# EAGLE design NanoRS485-MySens-v002 (EAGLE 7.6.0)
MAPLE-CUx Large Version
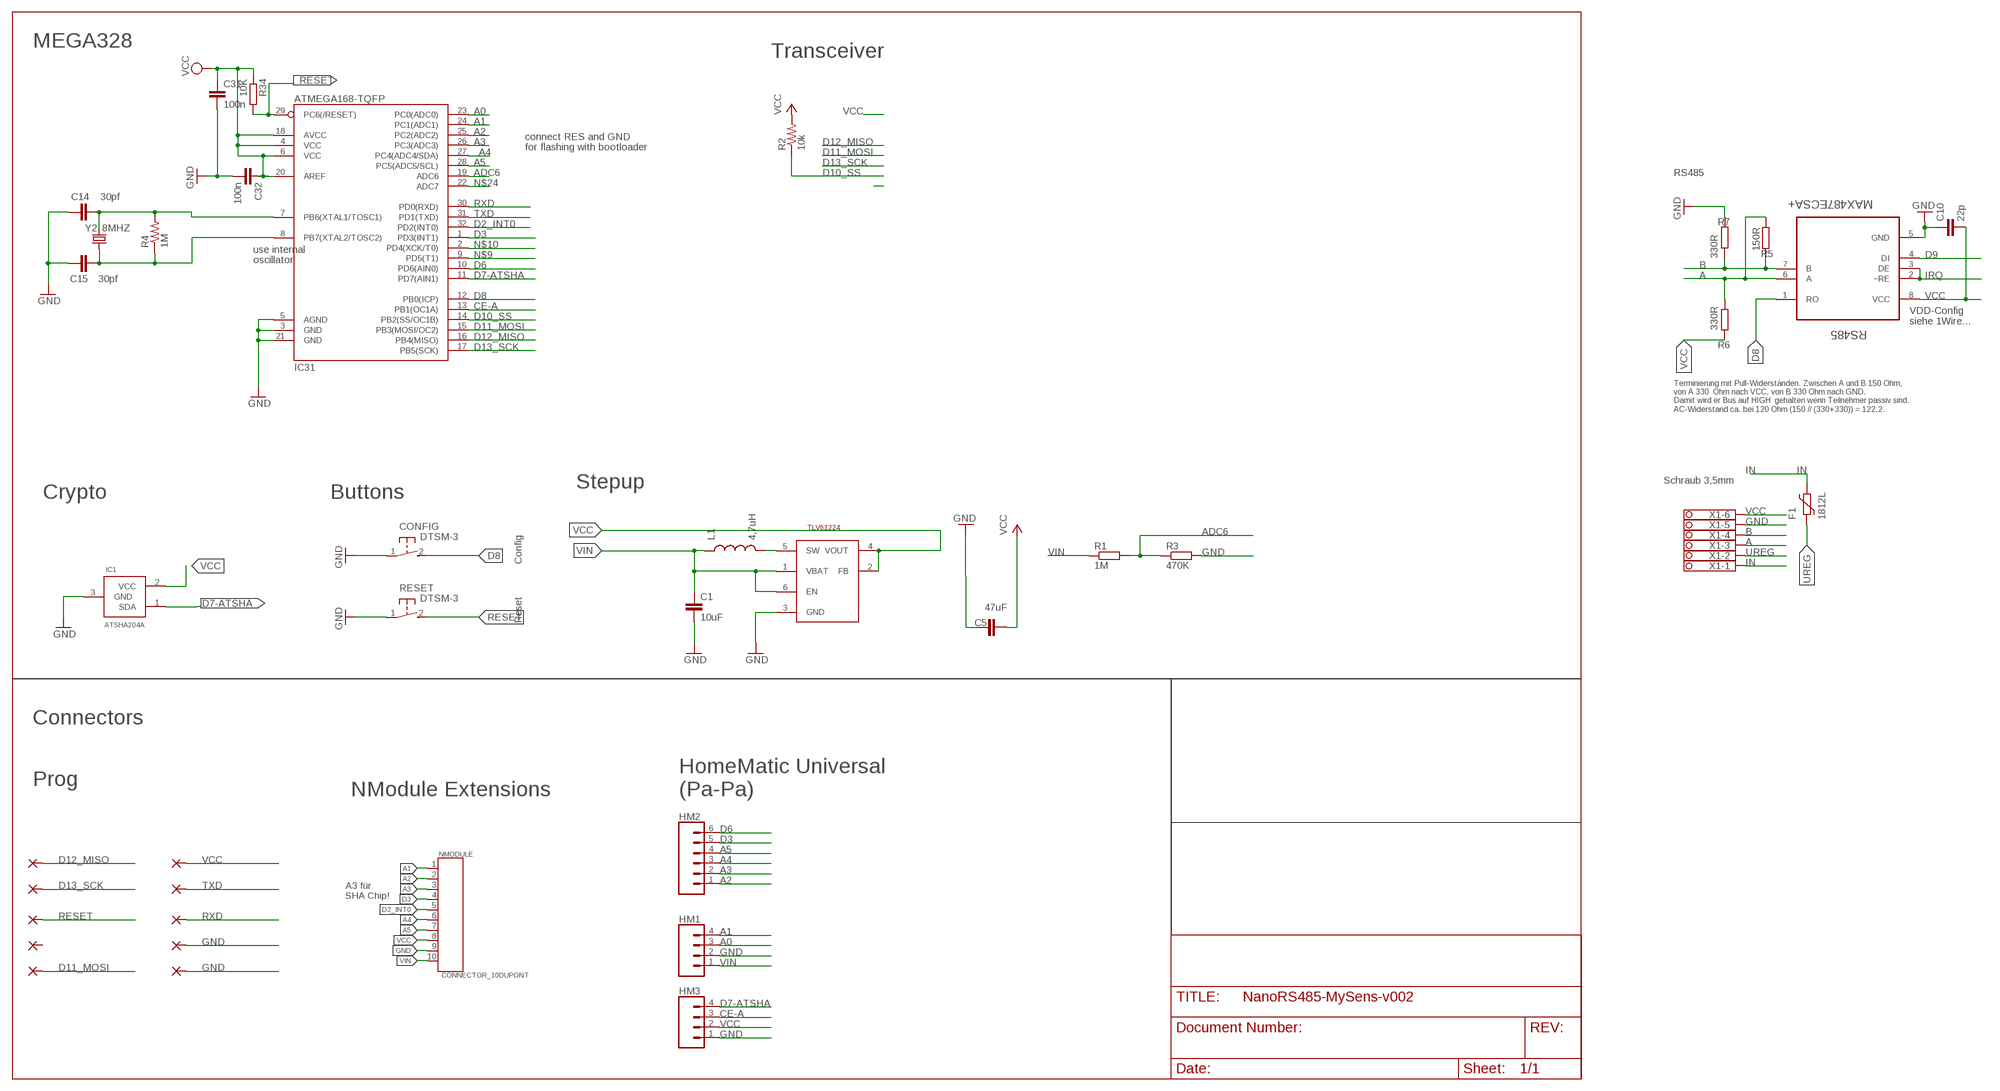
[diagram p0: schematic, sheet 1]

## Parts
C1  10uF  CAP0805  [0805]
C5  47uF  C-EUC1210  [C1210]
C10  22p  C-EUC0805  [C0805]
C14  30pf  CAP0805  [0805]
C15  30pf  CAP0805  [0805]
C31  100n  C-EUC0805  [C0805]
C32  100n  C-EUC0805  [C0805]
CONFIG  DTSM-3  [DTSM-3]
F1  1812L  [1812L]
GND  WIREPADSMD1,27-254  [SMD1,27-2,54]
GND2  WIREPADSMD1,27-254  [SMD1,27-2,54]
HM1  CONN_04  [1X04]
HM2  CONN_06SILK_FEMALE_PTH  [1X06]
HM3  CONN_04  [1X04]
IC1  ATSHA204A  [SOT23]
IC31  ATMEGA168-TQFP  [TQFP32-08]
L1  4,7uH  INDUCTOR0805  [0805]
MISO  WIREPADSMD1,27-254  [SMD1,27-2,54]
MOSI  WIREPADSMD1,27-254  [SMD1,27-2,54]
NC  WIREPADSMD1,27-254  [SMD1,27-2,54]
NMODULE  CONNECTOR_10DUPONT  [DUPONT_10]
R1  1M  R-EU_R0805  [R0805]
R2  10k  RESISTOR0805-RES  [0805]
R3  470K  R-EU_R0805  [R0805]
R4  1M  RESISTOR0805-RES  [0805]
R5  150R  R-EU_R0805  [R0805]
R6  330R  R-EU_R0805  [R0805]
R7  330R  R-EU_R0805  [R0805]
R34  10K  R-EU_R0805  [R0805]
RESET  DTSM-3  [DTSM-3]
RS485  MAX487ECSA+  [SOIC127P600X175-8N]
RST  WIREPADSMD1,27-254  [SMD1,27-2,54]
RXD  WIREPADSMD1,27-254  [SMD1,27-2,54]
SCK  WIREPADSMD1,27-254  [SMD1,27-2,54]
STEPUP  TLV61224  TI-TLV61224  [SOT23-6L]
TXD  WIREPADSMD1,27-254  [SMD1,27-2,54]
VCC  WIREPADSMD1,27-254  [SMD1,27-2,54]
X1  1751280  [1751280]
Y2  8MHZ  CRYSTALTXC-7A  [CRYSTAL-TXC-7A]

## Nets
A: R5.1 R6.2 RS485.6(A) X1.3
A0: HM1.3 IC31.23(PC0(ADC0))
A1: HM1.4 IC31.24(PC1(ADC1)) NMODULE.1
A2: HM2.1 IC31.25(PC2(ADC2)) NMODULE.2
A3: HM2.2 IC31.26(PC3(ADC3)) NMODULE.3
A4: HM2.3 IC31.27(PC4(ADC4/SDA)) NMODULE.6
A5: HM2.4 IC31.28(PC5(ADC5/SCL)) NMODULE.7
ADC6: IC31.19(ADC6) R1.2 R3.1
B: R5.2 R7.1 RS485.7(B) X1.4
CE-A: HM3.3 IC31.13(PB1(OC1A))
D2_INT0: IC31.32(PD2(INT0)) NMODULE.5
D3: HM2.5 IC31.1(PD3(INT1)) NMODULE.4
D6: HM2.6 IC31.10(PD6(AIN0))
D7-ATSHA: HM3.4 IC1.1(SDA) IC31.11(PD7(AIN1))
D8: CONFIG.2 IC31.12(PB0(ICP)) RS485.1(RO)
D9: RS485.4(DI)
D10_SS: IC31.14(PB2(SS/OC1B)) R2.1
D11_MOSI: IC31.15(PB3(MOSI/OC2)) MOSI.1(P)
D12_MISO: IC31.16(PB4(MISO)) MISO.1(P)
D13_SCK: IC31.17(PB5(SCK)) SCK.1(P)
GND [PWR]: C1.2 C5.1 C10.1 C14.1 C15.1 C31.2 C32.2 CONFIG.1 GND2.1(P) GND.1(P) HM1.2 HM3.1 IC1.3(GND) IC31.3(GND) IC31.5(AGND) IC31.21(GND) NMODULE.9 R3.2 R7.2 RESET.1 RS485.5(GND) STEPUP.3(GND) X1.5
IN [PWR]: F1.P$2 X1.1
IRQ: RS485.2(~RE) RS485.3(DE)
N$3: C14.2 IC31.7(PB6(XTAL1/TOSC1)) R4.2 Y2.P$2
N$9: IC31.9(PD5(T1))
N$10: IC31.2(PD4(XCK/T0))
N$13: L1.2 STEPUP.5(SW)
N$19: C15.2 IC31.8(PB7(XTAL2/TOSC2)) R4.1 Y2.P$1
N$24: IC31.22(ADC7)
RESET: IC31.29(PC6(/RESET)) R34.2 RESET.2 RST.1(P)
RXD: IC31.30(PD0(RXD)) RXD.1(P)
TXD: IC31.31(PD1(TXD)) TXD.1(P)
UREG [PWR]: F1.P$1 X1.2
VCC [PWR]: C5.2 C10.2 C31.1 C32.1 HM3.2 IC1.2(VCC) IC31.4(VCC) IC31.6(VCC) IC31.18(AVCC) IC31.20(AREF) NMODULE.8 R2.2 R6.1 R34.1 RS485.8(VCC) STEPUP.2(FB) STEPUP.4(VOUT) VCC.1(P) X1.6
VIN [PWR]: C1.1 HM1.1 L1.1 NMODULE.10 R1.1 STEPUP.1(VBAT) STEPUP.6(EN)
Unconnected: NC.1(P)

## Notes on the sheet
- MEGA328
- Transceiver
- connect RES and GND
- for flashing with bootloader
- RS485
- use internal
- oscillator
- VDD-Config
  siehe 1Wire...
- Terminierung mit Pull-Widerständen. Zwischen A und B 150 Ohm,
  von A 330  Ohm nach VCC, von B 330 Ohm nach GND. 
  Damit wird er Bus auf HIGH  gehalten wenn Teilnehmer passiv sind.
  AC-Widerstand ca. bei 120 Ohm (150 // (330+330)) = 122,2.
- Schraub 3,5mm
- Stepup
- Crypto | Buttons
- Config
- Reset
- Connectors
- Prog
- NModule Extensions
- HomeMatic Universal
  (Pa-Pa)
- A3 für 
  SHA Chip!

## Library data of the parts
C1 = SparkFun-Passives:CAP: Capacitor Standard 0603 ceramic capacitor, and 0.1" leaded capacitor.
C5 C10 C31 C32 = rcl:C-EU: CAPACITOR, European symbol
C14 C15 = doug:CAP: Capacitor Standard 0603 ceramic capacitor, and 0.1" leaded capacitor.
CONFIG RESET = mechanics:DTSM-3: Diptronics SMD button 6x3.5 mm
F1 = ptc-littlefuse:1812L
GND GND2 MISO MOSI NC RST RXD SCK TXD VCC = wirepad:WIREPAD: Wire PAD connect wire on PCB
HM1 HM3 = SparkFun-Connectors:CONN_04: Multi connection point. Often used as Generic Header-pin footprint for 0.1 inch spaced/style header connections On any of the 0.1 inch spaced packages, you can populate with these: Break Away Headers - Straight <https://www.sparkfun.com/products/116> (PRT-00116) Break Away Male Headers - Right Angle <https://www.sparkfun.com/products/553> (PRT-00553) Female Headers <https://www.sparkfun.com/products/115> (PRT-00115) Break Away Headers - Machine Pin <https://www.sparkfun.com/products/117> (PRT-00117) Break Away Female Headers - Swiss Machine Pin <https://www.sparkfun.com/products/743> (PRT-00743) For SCREWTERMINALS and SPRING TERMINALS visit here: Screw Terimnals on SparkFun.com <https://www.sparkfun.com/search/results?term=Screw+Terminals> (5mm/3.5mm/2.54mm spacing) This device is also useful as a general connection point to wire up your design to another part of your project. Our various solder wires solder well into these plated through hole pads. Hook-Up Wire - Assortment (Stranded, 22 AWG) <https://www.sparkfun.com/products/11375> (PRT-11375) Hook-Up Wire - Assortment (Solid Core, 22 AWG) <https://www.sparkfun.com/products/11367> (PRT-11367) View the entire wire category on our website here <https://www.sparkfun.com/categories/141> Special notes: Molex polarized connector foot print use with SKU : PRT-08231 with associated crimp pins and housings. 1MM SMD Version SKU: PRT-10208; PROD_ID: CONN-09696
HM2 = SparkFun-Connectors:CONN_06: Multi connection point. Often used as Generic Header-pin footprint for 0.1 inch spaced/style header connections On any of the 0.1 inch spaced packages, you can populate with these: Break Away Headers - Straight <https://www.sparkfun.com/products/116> (PRT-00116) Break Away Male Headers - Right Angle <https://www.sparkfun.com/products/553> (PRT-00553) Female Headers <https://www.sparkfun.com/products/115> (PRT-00115) Break Away Headers - Machine Pin <https://www.sparkfun.com/products/117> (PRT-00117) Break Away Female Headers - Swiss Machine Pin <https://www.sparkfun.com/products/743> (PRT-00743) Arduino Stackable Header - 6 Pin <https://www.sparkfun.com/products/9280> (PRT-09280) For SCREWTERMINALS and SPRING TERMINALS visit here: Screw Terimnals on SparkFun.com <https://www.sparkfun.com/search/results?term=Screw+Terminals> (5mm/3.5mm/2.54mm spacing) This device is also useful as a general connection point to wire up your design to another part of your project. Our various solder wires solder well into these plated through hole pads. Hook-Up Wire - Assortment (Stranded, 22 AWG) <https://www.sparkfun.com/products/11375> (PRT-11375) Hook-Up Wire - Assortment (Solid Core, 22 AWG) <https://www.sparkfun.com/products/11367> (PRT-11367) View the entire wire category on our website here <https://www.sparkfun.com/categories/141>; PROD_ID: CONN-08437
IC1 = Sensor:ATSHA204A
IC31 = atmel:ATMEGA168: Atmel Atmega 168/328/328P
L1 = SparkFun-Passives:INDUCTOR: Inductors Basic Inductor/Choke - 0603 and 1206. Footprints are not proven and vary greatly between part numbers.
NMODULE = TD-MySensors:CONNECTOR_10
R1 R3 R5-R7 R34 = rcl:R-EU_: RESISTOR, European symbol
R2 R4 = doug:RESISTOR: Resistor Basic schematic elements and footprints for 0603, 1206, and PTH resistors.
RS485 = Maxim_By_element14_Batch_1:MAX487ECSA+: Low-Power, Slew-Rate-Limited RS-485/RS-422 Transceivers; MPN: MAX487ECSA+; OC_FARNELL: 9724532; OC_NEWARK: 68K4803; PACKAGE: SOIC-8; SUPPLIER: Maxim
STEPUP = TLV61224:TI-TLV61224
X1 = con-phoenix-350:1751280: MKDS 1/ 6-3,5 Printklemme Nennstrom: 10 A Bemessungsspannung: 160 V Raster: 3,5 mm Polzahl: 6 Montageart: Löten Anschlussart: Schraubanschluss Anschlussrichtung vom Leiter zur Platine: 0° Source: http://eshop.phoenixcontact.com .. 1751280.pdf; MPN: 1751280; OC_FARNELL: unknown; OC_NEWARK: 27R1765
Y2 = SparkFun-FreqCtrl:CRYSTAL: Various standard crystals. Proven footprints.

## Net classes
0 default: width 0.305 mm
1 PWR: width 0.457 mm

## Board
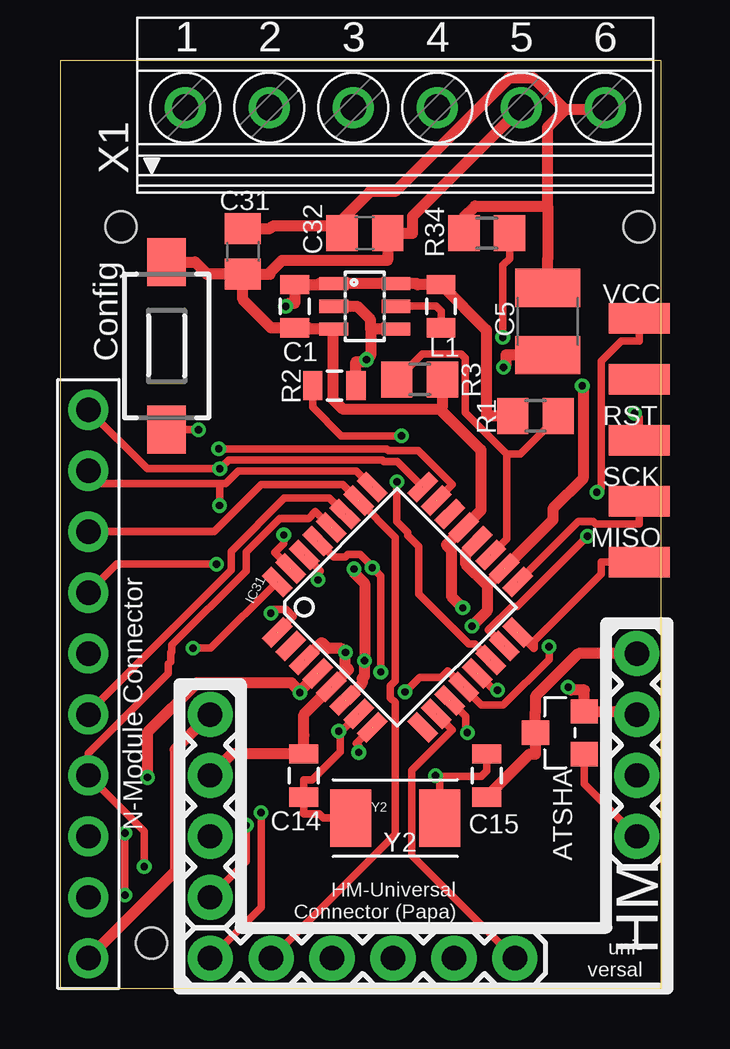
[diagram p1: board, top side]
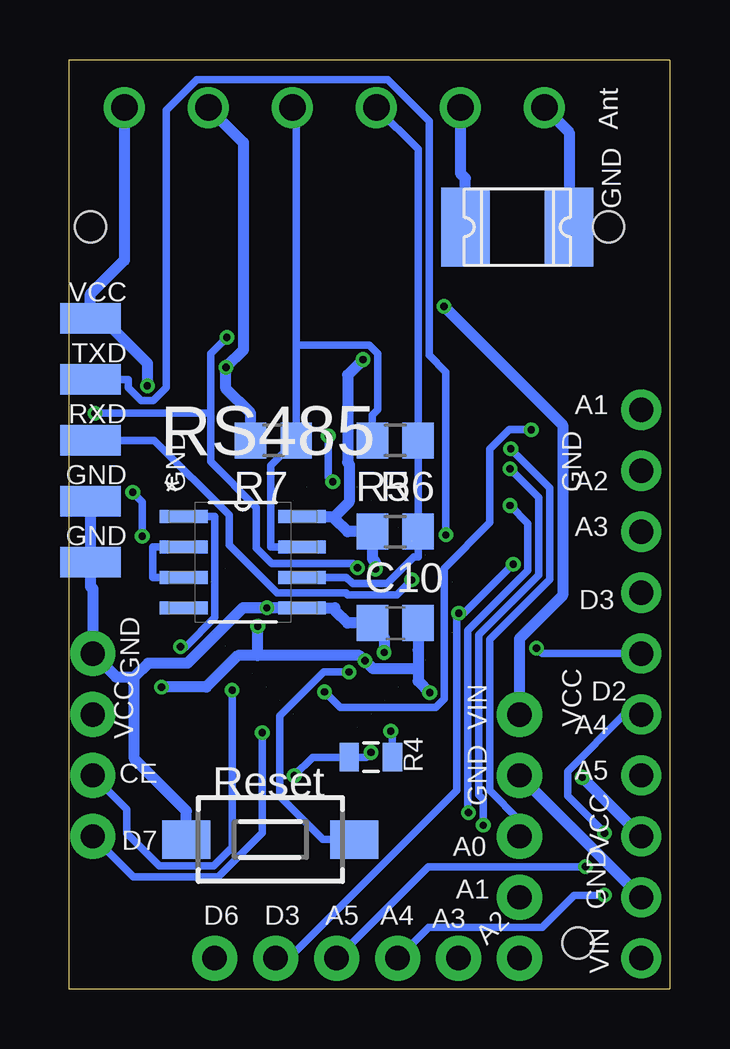
[diagram p2: board, bottom side, seen from below]

Size 25.04 x 38.72 mm. Coordinates in mm from the lower left corner, seen from the top.
Outline: 25.04,38.72 25.04,0 0,0 0,38.72 25.04,38.72
Copper layers (1*16): Top 0.035mm / dielectric 1.5mm / Bottom 0.035mm
Design rules "SeeedStudio_2layer_DRU_no_angle_20140221": minimum track width 6mil, minimum drill 12mil, track to track 6mil, track to pad 6mil, pad to pad 6mil, via to via 6mil, smd to smd 0mil, copper to edge 10mil, drill to drill 10mil, minimum pad ring 10mil, minimum via ring 6mil, stop-mask expansion 2mil, vias tented up to drill 100mil, thermal gap 10mil
Holes 1.3 mm at 24.13,31.75 2.54,31.75 3.81,1.91

### Footprints (pad centres in the part's own frame; a part is rotated, then mirrored left to right if it is on the bottom)
0805 = smd 0.8 x 1.2: 1 -0.9,0; 2 0.9,0
C1210 = smd 1.6 x 2.7: 1 -1.4,0; 2 1.4,0
C0805 = smd 1.3 x 1.5: 1 -0.95,0; 2 0.95,0
DTSM-3 = smd 2 x 1.6: 1 -3.494,0; 2 3.494,0
1812L = smd 2.03 x 3.3: P$1 -2.16,0; P$2 2.16,0
SMD1,27-2,54 = smd 1.27 x 2.54: 1 0,0
1X04 = drill 1.016 pad 1.88: 1 0,0; 2 2.54,0; 3 5.08,0; 4 7.62,0
1X06 = drill 1.016 pad 1.88: 1 0,0; 2 2.54,0; 3 5.08,0; 4 7.62,0; 5 10.16,0; 6 12.7,0
SOT23 = smd 1.016 x 1.143: 1 -0.889,-1.016; 2 0.889,-1.016; 3 0,1.016
TQFP32-08 = smd 1.27 x 0.559: 1 -4.293,2.8; 2 -4.293,2; 3 -4.293,1.2; 4 -4.293,0.4; 5 -4.293,-0.4; 6 -4.293,-1.2; 7 -4.293,-2; 8 -4.293,-2.8; 17 4.293,-2.8; 18 4.293,-2; 19 4.293,-1.2; 20 4.293,-0.4; 21 4.293,0.4; 22 4.293,1.2; 23 4.293,2; 24 4.293,2.8 | smd 0.559 x 1.27: 9 -2.8,-4.293; 10 -2,-4.293; 11 -1.2,-4.293; 12 -0.4,-4.293; 13 0.4,-4.293; 14 1.2,-4.293; 15 2,-4.293; 16 2.8,-4.293; 25 2.8,4.293; 26 2,4.293; 27 1.2,4.293; 28 0.4,4.293; 29 -0.4,4.293; 30 -1.2,4.293; 31 -2,4.293; 32 -2.8,4.293
DUPONT_10 = drill 1.016 pad 1.676: 1 1.27,1.27; 2 3.81,1.27; 3 6.35,1.27; 4 8.89,1.27; 5 11.43,1.27; 6 13.97,1.27; 7 16.51,1.27; 8 19.05,1.27; 9 21.59,1.27; 10 24.13,1.27
R0805 = smd 1.3 x 1.5: 1 -0.95,0; 2 0.95,0
SOIC127P600X175-8N = smd 1.981 x 0.533: 1 -2.464,1.905; 2 -2.464,0.635; 3 -2.464,-0.635; 4 -2.464,-1.905; 5 2.464,-1.905; 6 2.464,-0.635; 7 2.464,0.635; 8 2.464,1.905
SOT23-6L = smd 0.55 x 1.2: 1 -0.95,-1.3; 2 0,-1.3; 3 0.95,-1.3; 4 0.95,1.3; 5 0,1.3; 6 -0.95,1.3
1751280 = drill 1.1 pad 1.7: 1 -8.75,-0.1; 2 -5.25,-0.1; 3 -1.75,-0.1; 4 1.75,-0.1; 5 5.25,-0.1; 6 8.75,-0.1
CRYSTAL-TXC-7A = smd 1.7 x 2.4: P$1 1.85,0; P$2 -1.85,0

### Placement (x,y rotation side)
C1  9.78,28.45 270 top
C5  20.32,27.81 90 top
C10  11.43,15.24 0 bottom
C14  10.16,8.89 270 top
C15  17.78,8.89 90 top
C31  7.62,30.73 270 top
C32  12.7,31.5 0 top
CONFIG  4.45,26.8 270 top
F1  6.35,31.75 0 bottom
GND  24.13,17.78 90 bottom
GND2  24.13,20.32 90 bottom
HM1  6.25,11.43 270 top
HM2  6.25,1.27 0 top
HM3  24.04,13.97 270 top
IC1  20.83,10.67 90 top
IC31  14.06,15.9 45 top
L1  15.88,28.45 270 top
MISO  24.13,17.78 90 top
MOSI  24.13,27.94 90 top
NC  24.13,25.4 90 top
NMODULE  -0.09,25.4 270 top
R1  19.81,23.88 0 top
R2  11.43,25.15 0 top
R3  14.99,25.4 0 top
R4  12.45,9.65 0 bottom
R5  11.43,22.86 180 bottom
R6  11.43,19.05 0 bottom
R7  16.51,22.86 180 bottom
R34  17.78,31.5 0 top
RESET  16.64,6.22 0 bottom
RS485  17.78,17.78 0 bottom
RST  24.13,22.86 90 top
RXD  24.13,22.86 90 bottom
SCK  24.13,20.32 90 top
STEPUP  12.7,28.45 270 top
TXD  24.13,25.4 90 bottom
VCC  24.13,27.94 90 bottom
X1  13.97,36.83 0 top
Y2  13.97,7.11 0 top

### Tracks (layer width: path | path; a pad name or v marks a point on that pad's centre or on a via)
A
  Bottom 0.305: X1.3 10.48,34.99 10.48,23.91 R5.1 R6.2 10.48,18 10.65,18 11.77,16.88 13.21,16.88 13.47,17.14 14.02,17.14 RS485.6
A0  (via drill 0.3 pad 0.61)  (1 unrouted)
  Top 0.305: v6.62,22.5 13.62,22.5 13.69,22.44 14.93,22.44 16.35,21.02 IC31.23
  Bottom 0.305: v6.62,22.5 4.99,20.88 4.99,17.06 7.5,14.55 7.5,8.27 6.25,7.02 HM1.3
A1  (via drill 0.3 pad 0.61)  (1 unrouted)
  Top 0.305: IC31.24 14.05,21.98 13.5,21.98 13.43,22.04 7.02,22.04 v6.66,21.67 3.64,21.67 NMODULE.1 | HM1.4 7.76,5.32 v7.76,6.81
  Bottom 0.305: v6.66,21.67 5.45,20.47 5.45,17.25 7.96,14.74 7.96,8.08 7.76,7.89 v7.76,6.81
A2  (via drill 0.3 pad 0.61)  (1 unrouted)
  Top 0.305: 6.65,21.06 6.91,21.06 7.43,21.58 12.34,21.58 IC31.25 | 6.65,21.06 v6.65,20.14 | NMODULE.2 1.71,21.06 6.65,21.06 | HM2.1 8.38,3.39 v8.38,7.33
  Bottom 0.305: v6.65,20.14 5.91,19.4 5.91,17.44 8.41,14.93 8.41,7.37 v8.38,7.33
A3  (1 unrouted)
  Top 0.305: NMODULE.3 6.42,19.05 8.39,21.02 11.78,21.02 IC31.26 13.97,18.82 13.97,12.83 13.77,12.62 13.77,12.12 13.96,11.93 13.96,6.44 HM2.2
A4  (via drill 0.3 pad 0.61)  (1 unrouted)
  Top 0.305: NMODULE.6 1.18,11.5 7.13,17.45 7.13,18.23 9.35,20.45 11.21,20.45 IC31.27 | v2.71,3.9 v2.71,6.49
  Bottom 0.305: NMODULE.6 1.88,11.43 4.25,9.06 4.25,8.03 v2.71,6.49 | v2.71,3.9 3.98,3.9 5.31,2.56 10.04,2.56 HM2.3
A5  (via drill 0.3 pad 0.61)  (1 unrouted)
  Top 0.305: IC31.28 10.64,19.88 10.37,19.61 9.15,19.61 7.75,18.21 7.75,17.42 4.65,14.32 4.65,14.05 4.62,14.01 4.62,13.63 4.52,13.53 4.52,13.15 1.18,9.81 NMODULE.7 3.51,6.56 v3.51,5.09
  Bottom 0.305: v3.51,5.09 10.06,5.09 HM2.4
ADC6  (1 unrouted)
  Top 0.305: 18.61,22.3 18.61,18.75 IC31.19 | R3.1 15.09,26.46 16.72,26.46 16.89,26.29 16.89,24.02 18.61,22.3 | R1.2 19.18,22.3 18.61,22.3
B
  Bottom 0.305: 15.56,26.84 15.56,23.91 R7.1 16.61,21.81 16.61,18.41 RS485.7 | X1.4 15.56,36.57 15.56,26.84 | 15.56,26.84 12.51,26.84 12.16,26.48 12.16,24.13 12.38,23.91 R5.2
CE-A  (via drill 0.3 pad 0.61)  (1 unrouted)
  Top 0.305: v18.23,12.45 18.19,12.48 18.05,12.48 IC31.13
  Bottom 0.305: HM3.3 22.61,7.47 22.61,6.47 21.26,5.12 19,5.12 18.23,5.89 v18.23,12.45
D2_INT0  (via drill 0.3 pad 0.61)  (1 unrouted)
  Top 0.305: v5.54,14.2 6.29,14.2 IC31.32
  Bottom 0.305: NMODULE.5 5.31,13.97 v5.54,14.2
D3  (via drill 0.3 pad 0.61)  (1 unrouted)
  Top 0.305: NMODULE.4 2.37,17.7 v6.51,17.7 | v8.78,15.66 8.93,15.8 9.42,15.8 9.71,15.51 IC31.1
  Bottom 0.305: v6.51,17.7 8.56,15.66 v8.78,15.66 | v8.78,15.66 | HM2.5 15.86,1.27 8.87,8.26 8.87,15.57 v8.78,15.66
D6  (1 unrouted)
  Top 0.305: IC31.10 16.35,10.79 14.66,9.1 14.66,5.56 HM2.6
D7-ATSHA  (via drill 0.3 pad 0.61)  (1 unrouted)
  Top 0.305: HM3.4 21.84,8.54 IC1.1 | v16.97,10.68 16.91,10.74 16.91,11.35 IC31.11
  Bottom 0.305: HM3.4 22.34,4.66 18.81,4.66 16.97,6.5 v16.97,10.68
D8  (via drill 0.3 pad 0.61)  (1 unrouted)
  Top 0.305: CONFIG.2 v5.77,23.3 | v14.38,12.37 14.98,12.97 15.88,12.97 16.15,13.25 IC31.12 17.56,11.84 18.48,11.84 20.38,13.73 v20.38,14.25
  Bottom 0.305: v14.38,12.37 13.73,11.72 9.74,11.72 9.38,12.08 9.38,12.63 9.4,12.65 9.4,17.53 7.49,19.44 7.49,22.5 6.68,23.3 v5.77,23.3 | v20.38,14.25 20.17,14.25 18.95,15.47 18.95,19.68 RS485.1
D10_SS  (via drill 0.3 pad 0.61)  (1 unrouted)
  Top 0.305: 17.28,14.38 | 17.28,14.38 17.03,14.38 14.95,16.45 14.95,18.43 14.49,18.89 14.49,19.01 14.04,19.47 v14.04,21.13 | IC31.14 17.28,14.38 | R2.1 10.53,24.24 11.73,23.05 v14.22,23.05
  Bottom 0.305: v14.22,23.05 14.22,21.32 v14.04,21.13
D11_MOSI  (via drill 0.3 pad 0.61)  (1 unrouted)
  Top 0.305: MOSI.1 24.13,27 23.39,27 22.55,26.17 22.55,20.88 v22.37,20.69 | IC31.15 17.85,14.94 18.84,15.93 19.05,15.93 v21.97,18.86
  Bottom 0.305: v22.37,20.69 21.97,20.3 v21.97,18.86
D12_MISO  (1 unrouted)
  Top 0.305: MISO.1 22.55,17.78 22.55,17.3 19.77,14.51 19.77,14.21 19.74,14.18 IC31.16
D13_SCK  (1 unrouted)
  Top 0.305: IC31.17 19.74,17.62 21.59,19.47 22.23,19.47 22.31,19.38 24.13,19.38 SCK.1
GND  (via drill 0.3 pad 0.61)  (2 unrouted)
  Top 0.457: IC31.3 10.9,14.43 11.15,14.18 11.73,14.18 v11.89,14.02 11.89,13.44 12.03,13.3 IC31.5 10.16,11.43 10.16,10.57 C14.1 9.18,9.79 7.16,9.79 HM1.2 | v16.78,15.88 16.3,16.35 16.3,18.29 16.1,18.5 IC31.21 17.53,19.94 17.53,22.46 15.83,24.16 | HM3.1 21.6,13.97 19.81,12.18 19.81,11.56 IC1.3 19.81,9.78 19.57,9.78 C15.1 | C31.2 8.75,29.78 8.75,29.87 9.25,30.36 13.65,30.36 C32.2 14.68,31.5 14.68,32.19 X1.5 | C31.2 7.62,28.73 8.8,27.55 C1.2 10.37,27.55 10.42,27.5 11.2,27.5 11.31,27.5 11.36,27.5 | CONFIG.1 5.63,30.29 6.13,29.78 C31.2 | 15.83,24.16 15.94,24.27 R3.2 | 11.36,27.5 11.36,24.58 11.77,24.16 15.83,24.16 | STEPUP.3 11.36,27.5 | v18.48,25.9 18.59,26.01 18.59,26.41 C5.1
  Bottom 0.457: 12.45,15.24 11.89,14.68 v11.89,14.02 | 12.45,15.24 12.53,15.24 12.61,15.24 13.41,15.24 13.95,15.77 13.95,15.88 RS485.5 16.69,15.88 v16.78,15.88 17.78,15.88 20.09,13.57 21.73,13.57 22.3,12.99 | C10.1 12.45,15.24 | NMODULE.9 HM1.2 | X1.5 17.76,35.27 17.76,26.63 v18.48,25.9 18.48,25.02 17.46,23.99 R7.2 | 22.3,12.99 22.3,9.58 20.13,7.4 RESET.1 | 22.3,12.99 23.06,12.99 HM3.1 24.04,16.67 24.13,16.76 GND.1 GND2.1
IN
  Bottom 0.457: X1.1 4.19,35.7 F1.P$2
IRQ
  Bottom 0.305: RS485.2 21.54,18.41 21.54,17.14 RS485.3
N$3  (via drill 0.3 pad 0.61)  (1 unrouted)
  Top 0.305: v11.62,10.73 11.67,10.68 | Y2.P$2 10.96,7.11 10.79,7.29 10.16,7.29 C14.2 10.16,8.7 10.5,8.7 11.67,9.86 11.67,10.68 | 11.67,10.68 IC31.7
  Bottom 0.305: v11.62,10.73 11.62,10.63 11.55,10.56 R4.2 | v11.62,10.73
N$13
  Top 0.305: L1.2 15.88,28.25 15.68,28.45 STEPUP.5
N$19  (via drill 0.3 pad 0.61)  (1 unrouted)
  Top 0.305: 15.82,8.85 15.68,8.85 v15.64,8.89 | 15.82,8.85 15.82,8.62 Y2.P$1 | 15.82,8.85 17.55,8.85 17.78,9.09 C15.2 | v12.45,9.85 12.45,10.12 12.34,10.22 IC31.8
  Bottom 0.305: v15.64,8.89 14.88,9.65 14.05,9.65 R4.1 12.64,9.65 v12.45,9.85
RESET  (via drill 0.3 pad 0.61)  (1 unrouted)
  Top 0.305: v13.36,13.2 13.36,17.2 v13.01,17.55 13.01,17.61 12.51,18.11 12,18.11 11.88,17.99 11.41,17.99 IC31.29 | v23.94,23.99 24.13,23.8 RST.1 | v23.94,23.99 | R34.2 18.73,30.44 18.45,30.16 v18.45,27.15
  Bottom 0.305: 19.13,23.99 19.13,21.97 17.22,20.06 17.22,18.37 16.57,17.73 13.19,17.73 v13.01,17.55 | RESET.2 14.45,6.22 16.25,8.03 16.25,11.37 14.42,13.2 v13.36,13.2 | 19.13,23.99 v23.94,23.99 | v18.45,27.15 19.13,26.47 19.13,23.99
RXD  (via drill 0.3 pad 0.61)  (1 unrouted)
  Top 0.305: IC31.30 10.84,17.42 10.74,17.33 v10.74,17.04
  Bottom 0.305: RXD.1 21.47,22.86 18.36,19.75 18.36,18.49 16.35,16.49 13.47,16.49 13.41,16.42 11.37,16.42 v10.74,17.04
TXD  (via drill 0.3 pad 0.61)  (1 unrouted)
  Top 0.305: IC31.31 8.95,18.19 9.32,18.56 v9.32,18.92
  Bottom 0.305: TXD.1 22.55,25.4 22.55,25.05 22.02,24.52 21.51,24.52 20.97,25.05 20.97,36.62 19.7,37.89 11.74,37.89 10.02,36.17 10.02,26.41 9.32,25.71 v9.32,18.92
UREG
  Bottom 0.457: F1.P$1 8.51,33.78 8.72,33.99 X1.2
VCC  (via drill 0.3 pad 0.61)  (3 unrouted)
  Top 0.457: 17.79,16.8 | 17.79,16.8 17.79,15.74 v17.16,15.11 | v21.17,12.57 21.3,12.45 21.84,12.45 IC1.2 23.91,11.56 HM3.2 | v12.25,17.5 12.25,17.34 12.69,16.9 v12.69,13.67 12.69,13.5 12.68,13.48 12.68,13.02 12.59,12.93 12.59,12.74 | 12.59,12.74 | 17.79,16.8 IC31.18 20.54,19.55 20.54,20.01 21.79,21.27 21.79,25.1 v21.76,25.13 | 17.79,16.8 16.91,17.68 16.91,18.18 IC31.20 | IC31.6 12.59,12.74 | 12.94,27.5 12.94,27.89 12.38,28.45 STEPUP.2 | 9.99,12.4 9.64,12.75 5.71,12.75 3.64,10.68 v3.64,8.81 | 9.99,12.4 10.03,12.43 IC31.4 | v9.99,12.34 9.99,12.4 | 12.94,27.5 12.94,26.39 v12.77,26.23 12.68,26.13 12.33,26.13 R2.2 | 12.94,27.5 13.02,27.5 STEPUP.4 | C31.1 8.75,31.68 8.85,31.78 11.75,31.78 | 11.75,31.78 11.75,32.06 12.92,33.23 13.96,33.23 18.69,37.96 19.74,37.96 21.06,36.64 | C32.1 11.75,31.78 | 20.32,32.63 20.32,35.9 21.06,36.64 | X1.6 22.63,36.64 21.06,36.64 | 20.32,32.63 20.32,30.39 C5.2 | 20.32,32.63 17.29,32.63 16.83,32.16 R34.1
  Bottom 0.457: 10.48,13.33 12.36,13.33 v12.69,13.67 12.91,13.89 17.16,13.89 | 10.48,13.33 10.48,12.82 v9.99,12.34 | 10.48,13.33 10.48,14.11 C10.2 | 17.16,13.89 17.98,13.89 19.3,12.57 v21.17,12.57 | 17.16,13.89 v17.16,15.11 | v12.25,17.5 12.25,17.79 12.38,17.92 R6.1 13.41,19.05 13.95,19.58 13.95,19.68 | v3.64,8.81 NMODULE.8 | v12.77,26.23 13.41,25.58 13.41,21.95 13.35,21.89 13.35,20.28 13.95,19.68 | 13.95,19.68 13.96,19.68 RS485.8 | 24.13,28.45 21.76,26.08 v21.76,25.13 | 24.13,28.45 24.13,28.96 22.72,30.37 X1.6 | VCC.1 24.13,28.45
VIN  (via drill 0.3 pad 0.61)
  Top 0.457: v9.4,28.45 9.52,28.57 9.78,28.57 C1.1 10.76,29.35 10.81,29.4 STEPUP.1 STEPUP.6 14.84,29.4 14.89,29.35 L1.1 17.76,27.46 17.76,23.95 17.83,23.88 R1.1 | HM1.1 4.8,9.97 4.8,4.89 NMODULE.10
  Bottom 0.457: v9.4,28.45 4.46,23.5 4.46,16.38 6.25,14.59 HM1.1

### Text on the board
tPlace: HM | uni- / versal
tNames: easyMySensors-RFM69, RFM95 / by Ranseyer Micro V0.2 | C31 | C32 | R34 | VCC | C5 | Config | C1 | R3 | R2 | R1 | RST | SCK | MISO | N-Module Connector | C14 | Y2 | C15 | ATSHA | HM-Universal / Connector (Papa)
bNames: Ant | GND | VCC | TXD | A1 | RXD | A2 | GND | GND | GND | A3 | GND | D3 | D2 | GND | A4 | VCC | VIN | A5 | VCC | R4 | CE | GND | Reset | D7 | VCC | A0 | A1 | GND | A3 | A4 | A5 | D3 | D6 | A2 | VIN